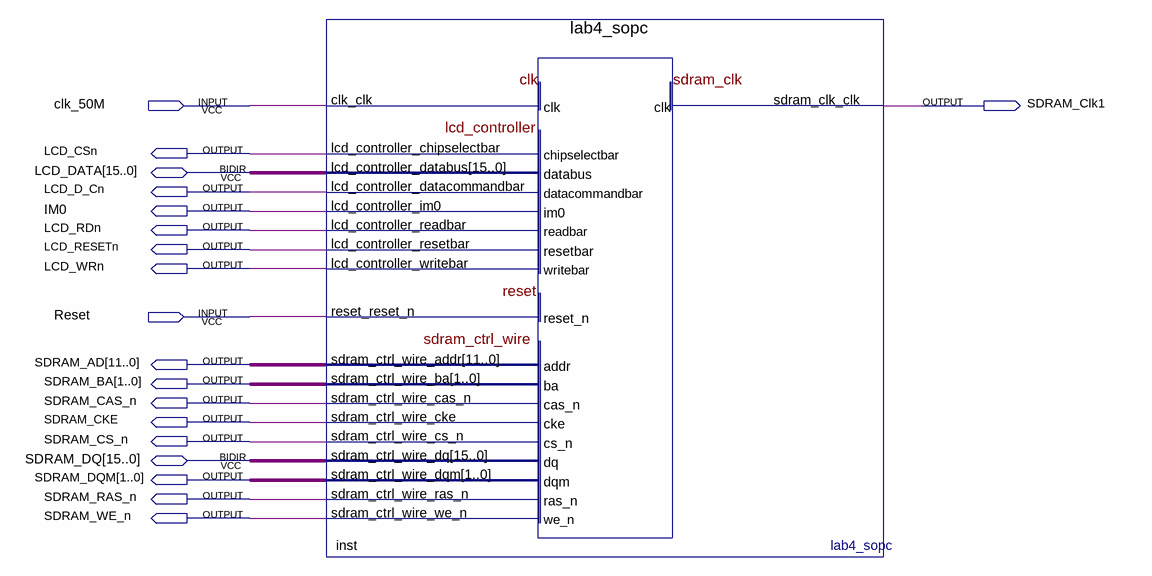
[diagram p0: schematic sheet]
// Quartus schematic lab4LCD.bdf as structural Verilog: 1 symbols, 19 pins
module lab4LCD (
  input  clk_50M,
  input  Reset,
  inout  [15:0] LCD_DATA,
  inout  [15:0] SDRAM_DQ,
  output SDRAM_Clk1,
  output LCD_CSn,
  output LCD_D_Cn,
  output IM0,
  output LCD_RDn,
  output LCD_RESETn,
  output LCD_WRn,
  output [11:0] SDRAM_AD,
  output [1:0] SDRAM_BA,
  output SDRAM_CAS_n,
  output SDRAM_CKE,
  output SDRAM_CS_n,
  output [1:0] SDRAM_DQM,
  output SDRAM_RAS_n,
  output SDRAM_WE_n
);

  lab4_sopc inst (
    .clk_clk(clk_50M), .reset_reset_n(Reset), .lcd_controller_chipselectbar(LCD_CSn),
    .lcd_controller_datacommandbar(LCD_D_Cn), .lcd_controller_im0(IM0), .lcd_controller_readbar(LCD_RDn),
    .lcd_controller_resetbar(LCD_RESETn), .lcd_controller_writebar(LCD_WRn), .sdram_clk_clk(SDRAM_Clk1),
    .sdram_ctrl_wire_addr(SDRAM_AD), .sdram_ctrl_wire_ba(SDRAM_BA), .sdram_ctrl_wire_cas_n(SDRAM_CAS_n),
    .sdram_ctrl_wire_cke(SDRAM_CKE), .sdram_ctrl_wire_cs_n(SDRAM_CS_n), .sdram_ctrl_wire_dqm(SDRAM_DQM),
    .sdram_ctrl_wire_ras_n(SDRAM_RAS_n), .sdram_ctrl_wire_we_n(SDRAM_WE_n),
    .lcd_controller_databus(LCD_DATA), .sdram_ctrl_wire_dq(SDRAM_DQ));
endmodule
